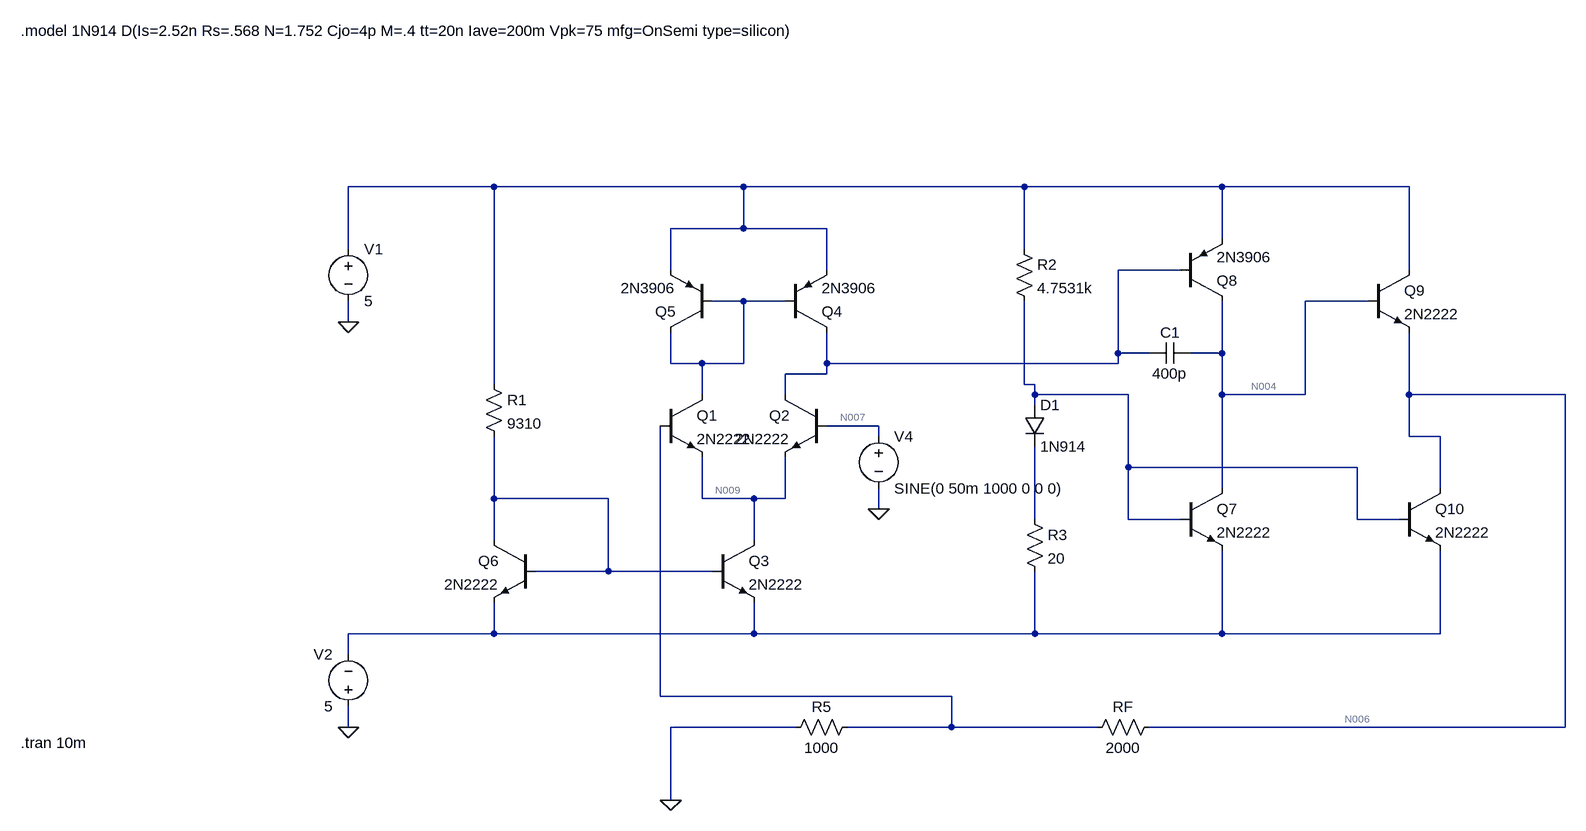
[diagram p0: schematic Final Operational Amplifier_3.asc]
Final Operational Amplifier_3.asc, the LTspice schematic file:
Version 4
SHEET 1 1420 680
WIRE -256 -448 -480 -448
WIRE 128 -448 -256 -448
WIRE 560 -448 128 -448
WIRE 864 -448 560 -448
WIRE 1152 -448 864 -448
WIRE 128 -384 128 -448
WIRE 128 -384 16 -384
WIRE 256 -384 128 -384
WIRE 864 -368 864 -448
WIRE -480 -352 -480 -448
WIRE 560 -352 560 -448
WIRE 16 -320 16 -384
WIRE 256 -320 256 -384
WIRE 800 -320 704 -320
WIRE 1152 -320 1152 -448
WIRE 128 -272 80 -272
WIRE 192 -272 128 -272
WIRE 1088 -272 992 -272
WIRE -480 -240 -480 -272
WIRE 704 -192 704 -320
WIRE 752 -192 704 -192
WIRE 864 -192 864 -272
WIRE 864 -192 816 -192
WIRE 16 -176 16 -224
WIRE 64 -176 16 -176
WIRE 128 -176 128 -272
WIRE 128 -176 64 -176
WIRE 256 -176 256 -224
WIRE 704 -176 704 -192
WIRE 704 -176 256 -176
WIRE 256 -160 256 -176
WIRE 256 -160 192 -160
WIRE -256 -144 -256 -448
WIRE 560 -144 560 -272
WIRE 576 -144 560 -144
WIRE 64 -128 64 -176
WIRE 192 -128 192 -160
WIRE 576 -128 576 -144
WIRE 720 -128 576 -128
WIRE 864 -128 864 -192
WIRE 992 -128 992 -272
WIRE 992 -128 864 -128
WIRE 1152 -128 1152 -224
WIRE 1392 -128 1152 -128
WIRE 576 -112 576 -128
WIRE 336 -80 256 -80
WIRE 336 -64 336 -80
WIRE 1152 -64 1152 -128
WIRE 1200 -64 1152 -64
WIRE 720 -16 720 -128
WIRE 1072 -16 720 -16
WIRE 864 16 864 -128
WIRE 1200 16 1200 -64
WIRE -256 32 -256 -64
WIRE -80 32 -256 32
WIRE 64 32 64 -32
WIRE 144 32 64 32
WIRE 192 32 192 -32
WIRE 192 32 144 32
WIRE 336 48 336 16
WIRE 576 64 576 -48
WIRE 720 64 720 -16
WIRE 800 64 720 64
WIRE 1072 64 1072 -16
WIRE 1136 64 1072 64
WIRE -256 96 -256 32
WIRE 144 96 144 32
WIRE -80 144 -80 32
WIRE -80 144 -192 144
WIRE 80 144 -80 144
WIRE -256 240 -256 192
WIRE -256 240 -480 240
WIRE 144 240 144 192
WIRE 144 240 -256 240
WIRE 576 240 576 144
WIRE 576 240 144 240
WIRE 864 240 864 112
WIRE 864 240 576 240
WIRE 1200 240 1200 112
WIRE 1200 240 864 240
WIRE -480 272 -480 240
WIRE 0 336 0 -80
WIRE 448 336 0 336
WIRE -480 384 -480 352
WIRE 208 384 16 384
WIRE 448 384 448 336
WIRE 448 384 288 384
WIRE 672 384 448 384
WIRE 1392 384 1392 -128
WIRE 1392 384 752 384
WIRE 16 496 16 384
FLAG -480 -240 0
FLAG -480 384 0
FLAG 336 48 0
FLAG 16 496 0
SYMBOL npn 0 -128 R0
SYMATTR InstName Q1
SYMATTR Value 2N2222
SYMBOL npn 256 -128 M0
SYMATTR InstName Q2
SYMATTR Value 2N2222
SYMBOL npn 80 96 R0
SYMATTR InstName Q3
SYMATTR Value 2N2222
SYMBOL pnp 192 -224 M180
SYMATTR InstName Q4
SYMATTR Value 2N3906
SYMBOL pnp 80 -224 R180
SYMATTR InstName Q5
SYMATTR Value 2N3906
SYMBOL npn -192 96 M0
SYMATTR InstName Q6
SYMATTR Value 2N2222
SYMBOL res -272 -160 R0
SYMATTR InstName R1
SYMATTR Value 9310
SYMBOL voltage -480 -368 R0
WINDOW 123 0 0 Left 0
WINDOW 39 0 0 Left 0
SYMATTR InstName V1
SYMATTR Value 5
SYMBOL voltage -480 368 R180
WINDOW 0 24 96 Left 2
WINDOW 3 24 16 Left 2
WINDOW 123 0 0 Left 0
WINDOW 39 0 0 Left 0
SYMATTR InstName V2
SYMATTR Value 5
SYMBOL res 544 -368 R0
SYMATTR InstName R2
SYMATTR Value 4.7531k
SYMBOL res 560 48 R0
SYMATTR InstName R3
SYMATTR Value 20
SYMBOL diode 560 -112 R0
SYMATTR InstName D1
SYMATTR Value 1N914
SYMBOL npn 800 16 R0
SYMATTR InstName Q7
SYMATTR Value 2N2222
SYMBOL pnp 800 -272 M180
SYMATTR InstName Q8
SYMATTR Value 2N3906
SYMBOL cap 816 -208 R90
WINDOW 0 0 32 VBottom 2
WINDOW 3 32 32 VTop 2
SYMATTR InstName C1
SYMATTR Value 400p
SYMBOL npn 1088 -320 R0
SYMATTR InstName Q9
SYMATTR Value 2N2222
SYMBOL npn 1136 16 R0
SYMATTR InstName Q10
SYMATTR Value 2N2222
SYMBOL voltage 336 -80 R0
WINDOW 123 24 44 Left 2
WINDOW 39 0 0 Left 0
SYMATTR InstName V4
SYMATTR Value SINE(0 50m 1000 0 0 0)
SYMBOL res 768 368 R90
WINDOW 0 0 56 VBottom 2
WINDOW 3 32 56 VTop 2
SYMATTR InstName RF
SYMATTR Value 2000
SYMBOL res 304 368 R90
WINDOW 0 0 56 VBottom 2
WINDOW 3 32 56 VTop 2
SYMATTR InstName R5
SYMATTR Value 1000
TEXT -984 -688 Left 2 !.model 1N914 D(Is=2.52n Rs=.568 N=1.752 Cjo=4p M=.4 tt=20n Iave=200m Vpk=75 mfg=OnSemi type=silicon)
TEXT -984 408 Left 2 !.tran 10m

The netlist it stands for:
* Final Operational Amplifier_3.asc
Q1 N003 N012 N009 0 2N2222
Q2 N002 N007 N009 0 2N2222
Q3 N009 N008 N011 0 2N2222
Q4 N002 N003 N001 0 2N3906
Q5 N003 N003 N001 0 2N3906
Q6 N008 N008 N011 0 2N2222
R1 N001 N008 9310
V1 N001 0 5
V2 0 N011 5
R2 N001 N005 4.7531k
R3 N010 N011 20
D1 N005 N010 1N914
Q7 N004 N005 N011 0 2N2222
Q8 N004 N002 N001 0 2N3906
C1 N004 N002 400p
Q9 N001 N004 N006 0 2N2222
Q10 N006 N005 N011 0 2N2222
V4 N007 0 SINE(0 50m 1000 0 0 0)
RF N006 N012 2000
R5 N012 0 1000
.model D D
.lib standard.dio
.model NPN NPN
.model PNP PNP
.lib standard.bjt
.model 1N914 D(Is=2.52n Rs=.568 N=1.752 Cjo=4p M=.4 tt=20n Iave=200m Vpk=75 mfg=OnSemi type=silicon)
.tran 10m
.backanno
.end

* Results of the author's LTspice run, read from the files saved beside the schematic
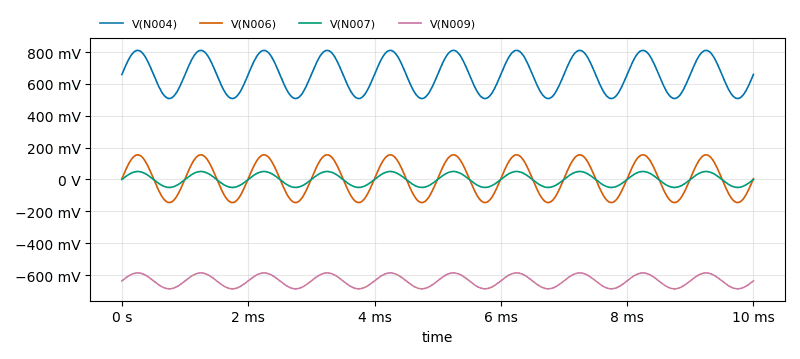
[diagram p1: Transient Analysis of Final Operational Amplifier_3.asc, plotted from the saved traces]
* Transient Analysis, 1 run:
*   V(N004): min 508.3 mV, max 810.8 mV, average 659.5 mV, rms 668.2 mV, last 659.5 mV
*   V(N006): min -145 mV, max 154.7 mV, average 4.856 mV, rms 106.1 mV, last 4.798 mV
*   V(N007): min -50 mV, max 50 mV, average -219.7 nV, rms 35.36 mV, last 0 V
*   V(N009): min -686.6 mV, max -586.7 mV, average -636.7 mV, rms 637.6 mV, last -636.7 mV